# EAGLE design ARTIC_R2_Module (EAGLE 9.6.2)
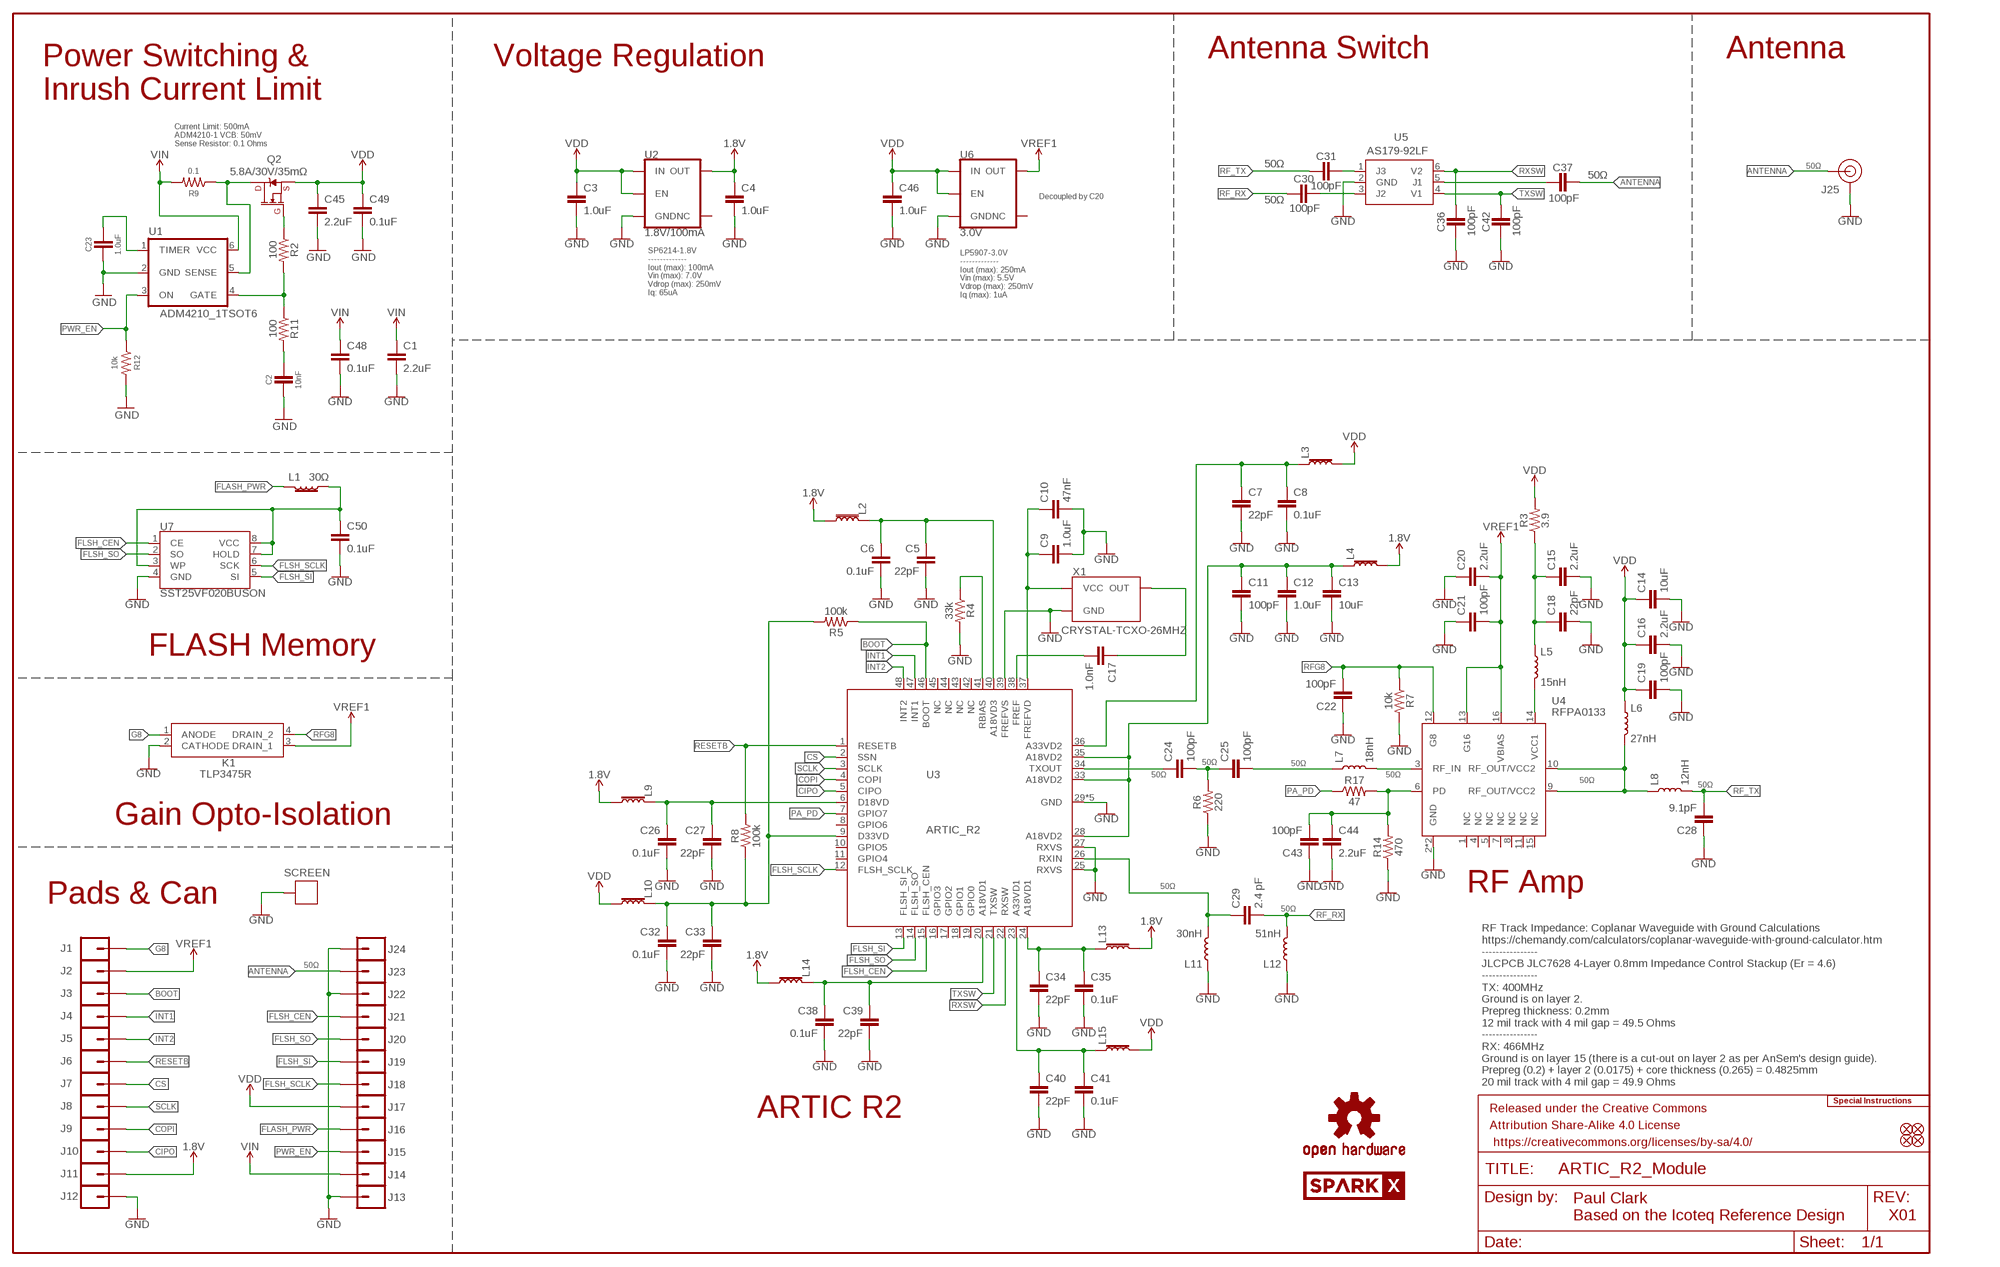
[diagram p0: schematic, sheet 1]

## Parts
C1  2.2uF  2.2UF-0402_TIGHT-10V-10%-X5R  [0402-TIGHT]
C2  10nF  10NF-0402T-25V-10%  [0402-TIGHT]
C3  1.0uF  1.0UF-0402T-16V-10%  [0402-TIGHT]
C4  1.0uF  1.0UF-0402T-16V-10%  [0402-TIGHT]
C5  22pF  22PF-0402T-16V-10%  [0402-TIGHT]
C6  0.1uF  0.1UF-0402T-6.3V-10%-X7R  [0402-TIGHT]
C7  22pF  22PF-0402T-16V-10%  [0402-TIGHT]
C8  0.1uF  0.1UF-0402T-6.3V-10%-X7R  [0402-TIGHT]
C9  1.0uF  1.0UF-0402T-16V-10%  [0402-TIGHT]
C10  47nF  47NF-0402_TIGHT-25V-10%-X7R  [0402-TIGHT]
C11  100pF  100PF-0402T-50V-5%  [0402-TIGHT]
C12  1.0uF  1.0UF-0402T-16V-10%  [0402-TIGHT]
C13  10uF  10UF-0402T-6.3V-20%  [0402-TIGHT]
C14  10uF  10UF-0402T-6.3V-20%  [0402-TIGHT]
C15  2.2uF  2.2UF-0402_TIGHT-10V-10%-X5R  [0402-TIGHT]
C16  2.2uF  2.2UF-0402_TIGHT-10V-10%-X5R  [0402-TIGHT]
C17  1.0nF  1.0NF/1000PF-0402_TIGHT-50V-10%  [0402-TIGHT]
C18  22pF  22PF-0402T-16V-10%  [0402-TIGHT]
C19  100pF  100PF-0402T-50V-5%  [0402-TIGHT]
C20  2.2uF  2.2UF-0402_TIGHT-10V-10%-X5R  [0402-TIGHT]
C21  100pF  100PF-0402T-50V-5%  [0402-TIGHT]
C22  100pF  100PF-0402T-50V-5%  [0402-TIGHT]
C23  1.0uF  1.0UF-0402T-16V-10%  [0402-TIGHT]
C24  100pF  100PF-0402T-50V-5%  [0402-TIGHT]
C25  100pF  100PF-0402T-50V-5%  [0402-TIGHT]
C26  0.1uF  0.1UF-0402T-6.3V-10%-X7R  [0402-TIGHT]
C27  22pF  22PF-0402T-16V-10%  [0402-TIGHT]
C28  9.1pF  9.1PF-0402-TIGHT  [0402-TIGHT]
C29  2.4 pF  2.4PF-0402  [0402_MURATA]
C30  100pF  100PF-0402T-50V-5%  [0402-TIGHT]
C31  100pF  100PF-0402T-50V-5%  [0402-TIGHT]
C32  0.1uF  0.1UF-0402T-6.3V-10%-X7R  [0402-TIGHT]
C33  22pF  22PF-0402T-16V-10%  [0402-TIGHT]
C34  22pF  22PF-0402T-16V-10%  [0402-TIGHT]
C35  0.1uF  0.1UF-0402T-6.3V-10%-X7R  [0402-TIGHT]
C36  100pF  100PF-0402T-50V-5%  [0402-TIGHT]
C37  100pF  100PF-0402T-50V-5%  [0402-TIGHT]
C38  0.1uF  0.1UF-0402T-6.3V-10%-X7R  [0402-TIGHT]
C39  22pF  22PF-0402T-16V-10%  [0402-TIGHT]
C40  22pF  22PF-0402T-16V-10%  [0402-TIGHT]
C41  0.1uF  0.1UF-0402T-6.3V-10%-X7R  [0402-TIGHT]
C42  100pF  100PF-0402T-50V-5%  [0402-TIGHT]
C43  100pF  100PF-0402T-50V-5%  [0402-TIGHT]
C44  2.2uF  2.2UF-0402_TIGHT-10V-10%-X5R  [0402-TIGHT]
C45  2.2uF  2.2UF-0402_TIGHT-10V-10%-X5R  [0402-TIGHT]
C46  1.0uF  1.0UF-0402T-16V-10%  [0402-TIGHT]
C48  0.1uF  0.1UF-0402T-10V-10%-X7R  [0402-TIGHT]
C49  0.1uF  0.1UF-0402T-10V-10%-X7R  [0402-TIGHT]
C50  0.1uF  0.1UF-0402T-6.3V-10%-X7R  [0402-TIGHT]
FD1  FIDUCIAL1X2  [FIDUCIAL-1X2]
FD2  FIDUCIAL1X2  [FIDUCIAL-1X2]
FD3  FIDUCIAL1X2  [FIDUCIAL-1X2]
FD4  FIDUCIAL1X2  [FIDUCIAL-1X2]
FRAME1  FRAME-LEDGER  [CREATIVE_COMMONS]
J1  CONN_01_CASTELLATED_4LAYERWITHOUT_VIA  [CONN_01_CASTELLATED_4LAYER]
J2  CONN_01_CASTELLATED_4LAYERWITHOUT_VIA  [CONN_01_CASTELLATED_4LAYER]
J3  CONN_01_CASTELLATED_4LAYERWITHOUT_VIA  [CONN_01_CASTELLATED_4LAYER]
J4  CONN_01_CASTELLATED_4LAYERWITHOUT_VIA  [CONN_01_CASTELLATED_4LAYER]
J5  CONN_01_CASTELLATED_4LAYERWITHOUT_VIA  [CONN_01_CASTELLATED_4LAYER]
J6  CONN_01_CASTELLATED_4LAYERWITHOUT_VIA  [CONN_01_CASTELLATED_4LAYER]
J7  CONN_01_CASTELLATED_4LAYERWITHOUT_VIA  [CONN_01_CASTELLATED_4LAYER]
J8  CONN_01_CASTELLATED_4LAYERWITHOUT_VIA  [CONN_01_CASTELLATED_4LAYER]
J9  CONN_01_CASTELLATED_4LAYERWITHOUT_VIA  [CONN_01_CASTELLATED_4LAYER]
J10  CONN_01_CASTELLATED_4LAYERWITHOUT_VIA  [CONN_01_CASTELLATED_4LAYER]
J11  CONN_01_CASTELLATED_4LAYERWITHOUT_VIA  [CONN_01_CASTELLATED_4LAYER]
J12  CONN_01_CASTELLATED_4LAYERWITHOUT_VIA  [CONN_01_CASTELLATED_4LAYER]
J13  CONN_01_CASTELLATED_4LAYERWITHOUT_VIA  [CONN_01_CASTELLATED_4LAYER]
J14  CONN_01_CASTELLATED_4LAYERWITHOUT_VIA  [CONN_01_CASTELLATED_4LAYER]
J15  CONN_01_CASTELLATED_4LAYERWITHOUT_VIA  [CONN_01_CASTELLATED_4LAYER]
J16  CONN_01_CASTELLATED_4LAYERWITHOUT_VIA  [CONN_01_CASTELLATED_4LAYER]
J17  CONN_01_CASTELLATED_4LAYERWITHOUT_VIA  [CONN_01_CASTELLATED_4LAYER]
J18  CONN_01_CASTELLATED_4LAYERWITHOUT_VIA  [CONN_01_CASTELLATED_4LAYER]
J19  CONN_01_CASTELLATED_4LAYERWITHOUT_VIA  [CONN_01_CASTELLATED_4LAYER]
J20  CONN_01_CASTELLATED_4LAYERWITHOUT_VIA  [CONN_01_CASTELLATED_4LAYER]
J21  CONN_01_CASTELLATED_4LAYERWITHOUT_VIA  [CONN_01_CASTELLATED_4LAYER]
J22  CONN_01_CASTELLATED_4LAYERWITHOUT_VIA  [CONN_01_CASTELLATED_4LAYER]
J23  CONN_01_CASTELLATED_4LAYERWITHOUT_VIA  [CONN_01_CASTELLATED_4LAYER]
J24  CONN_01_CASTELLATED_4LAYERWITHOUT_VIA  [CONN_01_CASTELLATED_4LAYER]
J25  U.FL  U.FL2PIN-REDUCED-FOOTPRINT  [U.FL_REDUCED_FOOTPRINT]
K1  TLP3475R  [TLP3475RTPF]
L1  30Ω  FERRITE_BEAD-0402-30OHM-100MHZ  [0402-TIGHT]
L2  30Ω  FERRITE_BEAD-0402-30OHM-100MHZ  [0402-TIGHT]
L3  30Ω  FERRITE_BEAD-0402-30OHM-100MHZ  [0402-TIGHT]
L4  30Ω  FERRITE_BEAD-0402-30OHM-100MHZ  [0402-TIGHT]
L5  15nH  15NH-0402  [0402_COILCRAFT]
L6  27nH  27NH-0402  [0402_COILCRAFT]
L7  18nH  18NH-0402  [0402_COILCRAFT]
L8  12nH  12NH-0402  [0402_COILCRAFT]
L9  30Ω  FERRITE_BEAD-0402-30OHM-100MHZ  [0402-TIGHT]
L10  30Ω  FERRITE_BEAD-0402-30OHM-100MHZ  [0402-TIGHT]
L11  30nH  30NH-0402  [0402_COILCRAFT]
L12  51nH  51NH-0402  [0402_COILCRAFT]
L13  30Ω  FERRITE_BEAD-0402-30OHM-100MHZ  [0402-TIGHT]
L14  30Ω  FERRITE_BEAD-0402-30OHM-100MHZ  [0402-TIGHT]
L15  30Ω  FERRITE_BEAD-0402-30OHM-100MHZ  [0402-TIGHT]
LOGO1  SPECIAL_INSTRUCTIONS-ORDERING  [ORDERING_INSTRUCTIONS]
LOGO3  OSHW-LOGOS  [OSHW-LOGO-S]
Q2  5.8A/30V/35mΩ  MOSFET-NCH-AO3404A  [SOT23-3]
R2  100  100OHM-0402-TIGHT-1/16W-1%  [0402-TIGHT]
R3  3.9  3.9OHM-0402-TIGHT-1/16W-1%  [0402-TIGHT]
R4  33k  33KOHM-0402T-1/16W-1%  [0402-TIGHT]
R5  100k  100KOHM-0402T-1/16W-1%  [0402-TIGHT]
R6  220  220OHM-0402-TIGHT-1/16W-1%  [0402-TIGHT]
R7  10k  10KOHM-0402T-1/16W-1%  [0402-TIGHT]
R8  100k  100KOHM-0402T-1/16W-1%  [0402-TIGHT]
R9  0.1  0.1OHM-0603-1/3W-1%  [0603]
R11  100  100OHM-0402-TIGHT-1/16W-1%  [0402-TIGHT]
R12  10k  10KOHM-0402T-1/16W-1%  [0402-TIGHT]
R14  470  470OHM-0402-TIGHT-1/16W-1%  [0402-TIGHT]
R17  47  47OHM-0402-TIGHT-1/16W-1%  [0402-TIGHT]
SCREEN  IOTA_SCREENING_CANSTRAIGHT_SLOTS  [IOTA_CAN_STRAIGHT_SLOTS]
SPARKX2  SPARKX-LOGO4  [SPARKX-MEDIUM]
U1  ADM4210_1TSOT6  [TSOT6]
U2  1.8V/100mA  V_REG_SP6214-1.8V  [SC70]
U3  ARTIC_R2  [QFN-48]
U4  RFPA0133  [QFN50P300X300X86-17N]
U5  AS179-92LF  [SOT65P220X100-6N]
U6  3.0V  V_REG_LP5907SOT23-3.0V  [SOT23-5]
U7  SST25VF020BUSON  [USON_3X2MM]
X1  CRYSTAL-TCXO-26MHZ  [CRYSTAL-TCXO-SMD-1.65X1.25]

## Nets
1.8V: C4.1 J11.1 L2.2 L4.2 L9.2 L13.2 L14.2 U2.5(OUT)
ANTENNA: C37.1 J23.1 J25.FEED(SIGNAL)
BOOT: J3.1 R5.1 U3.46(BOOT)
CIPO: J10.1 U3.5(CIPO)
COPI: J9.1 U3.4(COPI)
CS: J7.1 U3.2(SSN)
FLASH_PWR: J16.1 L1.2
FLASH_VCC: C50.1 L1.1 U7.3(WP) U7.7(HOLD) U7.8(VCC)
FLSH_CEN: J21.1 U3.15(FLSH_CEN) U7.1(CE)
FLSH_SCLK: J18.1 U3.12(FLSH_SCLK) U7.6(SCK)
FLSH_SI: J19.1 U3.13(FLSH_SI) U7.5(SI)
FLSH_SO: J20.1 U3.14(FLSH_SO) U7.2(SO)
G8: J1.1 K1.1(ANODE)
GND: C1.2 C2.2 C3.2 C4.2 C5.2 C6.2 C7.2 C8.2 C9.2 C10.2 C11.2 C12.2 C13.2 C14.2 C15.2 C16.2 C18.2 C19.2 C20.1 C21.1 C22.1 C23.2 C26.2 C27.2 C28.1 C32.2 C33.2 C34.2 C35.2 C36.2 C38.2 C39.2 C40.2 C41.2 C42.2 C43.1 C44.2 C45.2 C46.2 C48.2 C49.2 C50.2 J12.1 J13.1 J22.1 J24.1 J25.1(GND) J25.2(GND) K1.2(CATHODE) L11.P$1 L12.P$1 R4.2 R6.1 R7.2 R12.2 R14.1 SCREEN.1-1 SCREEN.1-16 SCREEN.2 SCREEN.3-1 SCREEN.3-16 SCREEN.4 U1.2(GND) U2.2(GND) U3.25(RXVS) U3.27(RXVS) U3.29(GND) U3.30(GND) U3.31(GND) U3.32(GND) U3.39(FREFVS) U3.GND U4.2(GND) U4.EDAP(GND) U5.2(GND) U6.2(GND) U7.4(GND) X1.1(GND) X1.2(GND)
INT1: J4.1 U3.47(INT1)
INT2: J5.1 U3.48(INT2)
N$1: Q2.3(D) R9.1 U1.5(SENSE)
N$2: Q2.1(G) R2.1
N$3: R2.2 R11.1 U1.4(GATE)
N$4: C34.1 C35.1 L13.1 U3.24(A18VD1)
N$5: C40.1 C41.1 L15.1 U3.23(A33VD1)
N$6: C2.1 R11.2
N$7: C23.1 U1.1(TIMER)
N$8: C26.1 C27.1 L9.1 U3.6(D18VD)
N$9: C32.1 C33.1 L10.1 R5.2 R8.1 U3.9(D33VD)
N$10: C11.1 C12.1 C13.1 L4.1 U3.28(A18VD2) U3.33(A18VD2) U3.35(A18VD2)
N$11: C7.1 C8.1 L3.1 U3.36(A33VD2)
N$12: R4.1 U3.41(RBIAS)
N$13: C5.1 C6.1 L2.1 U3.40(A18VD3)
N$14: C9.1 C10.1 U3.37(FREFVD) X1.4(VCC)
N$15: C17.1 X1.3(OUT)
N$16: C17.2 U3.38(FREF)
N$17: C24.1 U3.34(TXOUT)
N$18: C24.2 C25.1 R6.2
N$19: L5.P$2 U4.14(VCC1)
N$20: C15.1 C18.1 L5.P$1 R3.1
N$21: C29.P$1 L11.P$2 U3.26(RXIN)
N$24: C25.2 L7.P$1
N$25: L7.P$2 U4.3(RF_IN)
N$26: L6.P$2 L8.P$1 U4.9(RF_OUT/VCC2) U4.10(RF_OUT/VCC2)
N$28: C31.1 U5.1(J3)
N$29: C30.1 U5.3(J2)
N$30: C37.2 U5.5(J1)
N$31: C38.1 C39.1 L14.1 U3.20(A18VD1)
PA_PD: R17.1 U3.7(GPIO7)
PD: C43.2 C44.1 R14.2 R17.2 U4.6(PD)
PWR_EN: J15.1 R12.1 U1.3(ON)
RESETB: J6.1 R8.2 U3.1(RESETB)
RF_RX: C29.P$2 C30.2 L12.P$2
RF_TX: C28.2 C31.2 L8.P$2
RFG8: C22.2 K1.4(DRAIN_2) R7.1 U4.12(G8)
RXSW: C36.1 U3.22(RXSW) U5.6(V2)
SCLK: J8.1 U3.3(SCLK)
TXSW: C42.1 U3.21(TXSW) U5.4(V1)
VDD: C3.1 C14.1 C16.1 C19.1 C45.1 C46.1 C49.1 J17.1 L3.2 L6.P$1 L10.2 L15.2 Q2.2(S) R3.2 U2.1(IN) U2.3(EN) U6.1(IN) U6.3(EN)
VIN: C1.1 C48.1 J14.1 R9.2 U1.6(VCC)
VREF1: C20.2 C21.2 J2.1 K1.3(DRAIN_1) U4.13(G16) U4.16(VBIAS) U6.5(OUT)
Unconnected: U2.4(NC) U3.8(GPIO6) U3.10(GPIO5) U3.11(GPIO4) U3.16(GPIO3) U3.17(GPIO2) U3.18(GPIO1) U3.19(GPIO0) U3.42(NC) U3.43(NC) U3.44(NC) U3.45(NC) U4.1(NC) U4.4(NC) U4.5(NC) U4.7(NC) U4.8(NC) U4.11(NC) U4.15(NC) U6.4(NC)

## Notes on the sheet
- Voltage Regulation | Antenna Switch | Antenna
- Power Switching &
  Inrush Current Limit
- Current Limit: 500mA
  ADM4210-1 VCB: 50mV
  Sense Resistor: 0.1 Ohms
- 50Ω | 50Ω
- 50Ω
- Decoupled by C20
- 50Ω
- SP6214-1.8V
  -------------
  Iout (max): 100mA 
  Vin (max): 7.0V
  Vdrop (max): 250mV
  Iq: 65uA
- LP5907-3.0V
  -------------
  Iout (max): 250mA 
  Vin (max): 5.5V
  Vdrop (max): 250mV
  Iq (max): 1uA
- FLASH Memory
- 50Ω | 50Ω
- 50Ω | 50Ω
- 50Ω
- 50Ω
- Gain Opto-Isolation
- 50Ω
- RF Amp
- Pads & Can
- 50Ω
- RF Track Impedance: Coplanar Waveguide with Ground Calculations
  https://chemandy.com/calculators/coplanar-waveguide-with-ground-calculator.htm
  ----------------
  JLCPCB JLC7628 4-Layer 0.8mm Impedance Control Stackup (Er = 4.6)
  ----------------
  TX: 400MHz
  Ground is on layer 2.
  Prepreg thickness: 0.2mm
  12 mil track with 4 mil gap = 49.5 Ohms
  ----------------
  RX: 466MHz
  Ground is on layer 15 (there is a cut-out on layer 2 as per AnSem's design guide).
  Prepreg (0.2) + layer 2 (0.0175) + core thickness (0.265) = 0.4825mm
  20 mil track with 4 mil gap = 49.9 Ohms
- 50Ω
- ARTIC R2
- Paul Clark
  Based on the Icoteq Reference Design
- X01

## Library data of the parts
C1 C15 C16 C20 C44 C45 = SparkFun-Capacitors:2.2UF: 2.2µF ceramic capacitors A capacitor is a passive two-terminal electrical component used to store electrical energy temporarily in an electric field.; PROD_ID: CAP-14232
C2 = SparkFun-Capacitors:10NF: 0.01uF/10nF/10,000pF ceramic capacitors A capacitor is a passive two-terminal electrical component used to store electrical energy temporarily in an electric field. CAP-09321; PROD_ID: CAP-14847
C3 C4 C9 C12 C23 C46 = SparkFun-Capacitors:1.0UF: 1µF ceramic capacitors A capacitor is a passive two-terminal electrical component used to store electrical energy temporarily in an electric field.; PROD_ID: CAP-12417
C5 C7 C18 C27 C33 C34 C39 C40 = SparkFun-Capacitors:22PF: 22pF ceramic capacitors A capacitor is a passive two-terminal electrical component used to store electrical energy temporarily in an electric field.; PROD_ID: CAP-14674
C6 C8 C26 C32 C35 C38 C41 C50 = SparkFun-Capacitors:0.1UF: 0.1µF ceramic capacitors A capacitor is a passive two-terminal electrical component used to store electrical energy temporarily in an electric field.; PROD_ID: CAP-14993
C10 = SparkFun-Capacitors:47NF: 47nF ceramic capacitors A capacitor is a passive two-terminal electrical component used to store electrical energy temporarily in an electric field.; PROD_ID: CAP-14243
C11 C19 C21 C22 C24 C25 C30 C31 C36 C37 C42 C43 = SparkFun-Capacitors:100PF: 100pF/0.1nF ceramic capacitors A capacitor is a passive two-terminal electrical component used to store electrical energy temporarily in an electric field.; PROD_ID: CAP-13458
C13 C14 = SparkFun-Capacitors:10UF: 10.0µF ceramic capacitors A capacitor is a passive two-terminal electrical component used to store electrical energy temporarily in an electric field.; PROD_ID: CAP-14848
C17 = SparkFun-Capacitors:1.0NF/1000PF: 1nF/1,000pF ceramic capacitors A capacitor is a passive two-terminal electrical component used to store electrical energy temporarily in an electric field.; PROD_ID: CAP-14280
C28 = SparkFun-Capacitors:9.1PF: 9.1pF ceramic capacitors A capacitor is a passive two-terminal electrical component used to store electrical energy temporarily in an electric field.; MOUSER_PART: 609-500R07S9R1CV4T; PROD_ID: CAP-15278
C29 = SparkFun-Capacitors:2.4PF; PROD_ID: CAP-14351
C48 C49 = SparkFun-Capacitors:0.1UF: 0.1µF ceramic capacitors A capacitor is a passive two-terminal electrical component used to store electrical energy temporarily in an electric field.; PROD_ID: CAP-15083
FD1-FD4 = SparkFun-Aesthetics:FIDUCIAL: Fiducial Alignment Points Point-of-reference for pick-and-place machines and other optical instruments.
FRAME1 = SparkFun-Aesthetics:FRAME-LEDGER: Schematic Frame - Ledger Standard 11x14 US Ledger frame
J1-J24 = New_Parts_Connectors:CONN_01_CASTELLATED_4LAYER: A castellated pad for 4-layer boards. Place the center of the pad on the dimension line. You will get a bunch of dimension and drill distance errors but there's not much we can do about that.
J25 = SparkFun-Connectors:U.FL2PIN: SMD Antenna Connector - U.FL 2mm height, 3.0mm x 3.0mm receptacle size. SparkFun Products: SparkFun WiFi Shield - ESP8266 <https://www.sparkfun.com/products/13287> SparkFun ESP8266 Thing <https://www.sparkfun.com/products/13231> SparkFun MiniGen - Pro Mini Signal Generator Shield <https://www.sparkfun.com/products/11420>; PROD_ID: CONN-09193
K1 = SparkFun-DiscreteSemi:TLP3475R: Solid State Relays - PCB Mount Photo-IC 300mA 50V 500Vrms Source: Datasheet <http://toshiba.semicon-storage.com/info/docget.jsp?did=55304&prodName=TLP3475R> OBSOLETE - use TLP3475SRHA; DESCRIPTION: Solid State Relays - PCB Mount Photo-IC 300mA 50V 500Vrms; DIGIKEY_PART: TLP3475R(TPFCT-ND - Cut Tape (CT); MANUFACTURER_NAME: Toshiba; MANUFACTURER_PART_NUMBER: TLP3475R; PROD_ID: IC-15447
L1-L4 L9 L10 L13-L15 = SparkFun-Coils:FERRITE_BEAD: Ferrite Bead (blocks, cores, rings, chokes, etc.) Inductor with layers of ferrite used to suppress high frequencies. Often used to isolate high frequency noise. SparkFun Products: IOIO-OTG - V2.2 <https://www.sparkfun.com/products/13613> SparkFun SAMD21 Mini Breakout <https://www.sparkfun.com/products/13664> SparkFun 6 Degrees of Freedom Breakout - LSM6DS3 <https://www.sparkfun.com/products/13339> SparkFun SAMD21 Dev Breakout <https://www.sparkfun.com/products/13672>; PROD_ID: NDUC-15133
L5 = SparkFun-Coils:15NH; MOUSER_PART: 994-0402HP-15NXGLU; PROD_ID: NDUC-15272
L6 = SparkFun-Coils:27NH; MOUSER_PART: 994-0402HP-27NXGLU; PROD_ID: NDUC-15273
L7 = SparkFun-Coils:18NH; MOUSER_PART: 994-0402HP-18NXGLU; PROD_ID: NDUC-15277
L8 = SparkFun-Coils:12NH; MOUSER_PART: 994-0402HP-12NXGLU; PROD_ID: NDUC-15271
L11 = SparkFun-Coils:30NH; MOUSER_PART: 994-0402HP-30NXGLU; PROD_ID: NDUC-15275
L12 = SparkFun-Coils:51NH; MOUSER_PART: 994-0402HP-51NXGLU; PROD_ID: NDUC-15276
LOGO1 = SparkFun-Aesthetics:SPECIAL_INSTRUCTIONS: Special Ordering/Production Instructions Alert Symbol for special PCB ordering instructions or unique production process warnings. Ordering Instructions Production Instructions Types of information that should be added to box: Copper weight Soldermask color Silk color PCB thickness Number of layers PCB Standard: 1.6mm FR4 1 oz copper immersion silver plating red soldermask white silkscreen Types of information that should be added to box: Special wash requirements Depaneling instructions Humidification Glue curing Default text settings: 0.07 inch 9% ratio 50% line distance
LOGO3 = SparkFun-Aesthetics:OSHW-LOGO: Open-Source Hardware (OSHW) Logo This logo indicates the piece of hardware it is found on incorporates a OSHW license and/or adheres to the definition of open source hardware found here: http://freedomdefined.org/OSHW
Q2 = SparkFun-DiscreteSemi:MOSFET-NCH: N-channel MOSFETs Voltage controlled devices that allow control of high current outputs. SparkFun Products: SparkFun OpenScale <https://www.sparkfun.com/products/13261> SparkFun Digital Sandbox <https://www.sparkfun.com/products/12651> SparkFun Monster Moto Shield <https://www.sparkfun.com/products/10182> SparkFun MOSFET Power Controller <https://www.sparkfun.com/products/11214>; PROD_ID: TRANS-12988
R2 R11 = SparkFun-Resistors:100OHM: 100Ω resistor A resistor is a passive two-terminal electrical component that implements electrical resistance as a circuit element. Resistors act to reduce current flow, and, at the same time, act to lower voltage levels within circuits. - Wikipedia; PROD_ID: RES-14962
R3 = SparkFun-Resistors:3.9OHM: 3.9Ω resistor A resistor is a passive two-terminal electrical component that implements electrical resistance as a circuit element. Resistors act to reduce current flow, and, at the same time, act to lower voltage levels within circuits. - Wikipedia; PROD_ID: RES-15270
R4 = SparkFun-Resistors:33KOHM: 33kΩ resistor A resistor is a passive two-terminal electrical component that implements electrical resistance as a circuit element. Resistors act to reduce current flow, and, at the same time, act to lower voltage levels within circuits. - Wikipedia; PROD_ID: RES-15128
R5 R8 = SparkFun-Resistors:100KOHM: 100kΩ resistor A resistor is a passive two-terminal electrical component that implements electrical resistance as a circuit element. Resistors act to reduce current flow, and, at the same time, act to lower voltage levels within circuits. - Wikipedia; PROD_ID: RES-13495
R6 = SparkFun-Resistors:220OHM: 220Ω resistor A resistor is a passive two-terminal electrical component that implements electrical resistance as a circuit element. Resistors act to reduce current flow, and, at the same time, act to lower voltage levels within circuits. - Wikipedia; PROD_ID: RES-15269
R7 R12 = SparkFun-Resistors:10KOHM: 10kΩ resistor A resistor is a passive two-terminal electrical component that implements electrical resistance as a circuit element. Resistors act to reduce current flow, and, at the same time, act to lower voltage levels within circuits. - Wikipedia; PROD_ID: RES-14241
R9 = SparkFun-Resistors:0.1OHM: 0.1Ω resistor A resistor is a passive two-terminal electrical component that implements electrical resistance as a circuit element. Resistors act to reduce current flow, and, at the same time, act to lower voltage levels within circuits. - Wikipedia; PROD_ID: RES-15715
R14 = SparkFun-Resistors:470OHM: 470Ω resistor A resistor is a passive two-terminal electrical component that implements electrical resistance as a circuit element. Resistors act to reduce current flow, and, at the same time, act to lower voltage levels within circuits. - Wikipedia; PROD_ID: RES-15584
R17 = SparkFun-Resistors:47OHM: 47Ω resistor A resistor is a passive two-terminal electrical component that implements electrical resistance as a circuit element. Resistors act to reduce current flow, and, at the same time, act to lower voltage levels within circuits. - Wikipedia; PROD_ID: RES-15585
SCREEN = New_Parts_Screening_Cans:IOTA_SCREENING_CAN: A screening can for the IOTA ARGOS ARTIC R2 castellated module
SPARKX2 = SparkX:SPARKX-LOGO
U1 = SparkFun-IC-Power:ADM4210_1: Hot Swap Controller (In-Rush Current Limiter); PROD_ID: IC-14694
U2 = SparkFun-IC-Power:V_REG_SP6214: Voltage Regulator - SP6214 SP6214 Series SC-70-5 Micropower SC-70 100 mA CMOS LDO Regulator Datasheet <https://www.exar.com/content/document.ashx?id=654> SparkFun Products: MP3 Trigger <https://www.sparkfun.com/products/13720> SparkFun Particle Sensor Breakout <https://www.sparkfun.com/products/14045>; PROD_ID: VREG-08428
U3 = SparkFun-RF:ARTIC_R2: AnSem ARTIC R2 Chipset The ARTIC is an integrated low power small size ARGOS 2/3/4 single chip radio. ARTIC implements a message based wireless interface. For satellite uplink communication, ARTIC will encode, modulate and transmit provided user messages. For downlink communication, ARTIC will lock to the downstream, demodulate and decode and extract the satellite messages. The ARTIC can transmit signals in frequency bands around 400MHz and receive signals in the bands around 466MHz, in accordance with the ARGOS satellite system specifications. The ARTIC is compliant and certified for all ARGOS 2 and ARGOS 3 TX standards. It contains a RF transceiver, afrequency synthesizer and a digital baseband modem. The ARTIC contains an on-chip power amplifier delivering 1mW [0dBm] output power, that serves as an output for connecting an external high efficient PA. The (de)modulation algorithms run on an on-chip DSP. This software approach allows for retargeting the ARTIC for other applications. The DSP program can be retained on an external flash or the MCU.; PROD_ID: IC-15312
U4 = SparkFun-RF:RFPA0133: IC PROG PWR AMP 16-QFN Source: Datasheet <http://www.qorvo.com/products/d/da000936>; MANUFACTURER_NAME: Qorvo; MANUFACTURER_PART_NUMBER: RFPA0133TR7; MOUSER_PART_NUMBER: 772-RFPA0133; PROD_ID: IC-15274
U5 = SparkFun-RF:AS179-92LF: SKYWORKS SOLUTIONS - AS179-92LF - IC, SWITCH, RF, SPDT, 0.02-3.0GHZ Source: Datasheet <http://www.skyworksinc.com/uploads/documents/AS179_92LF_200176H.pdf>; PROD_ID: IC-15047
U6 = SparkFun-IC-Power:V_REG_LP5907: LP5907 - 250mA Ultra-Low-Noise LDO Regulator w/ Enable The LP5907 is a low-noise LDO that can supply up to 250 mA output current. Designed to meet the requirements of RF and analog circuits, the LP5907 device provides low noise, high PSRR, low quiescent current, and low line or load transient response figures. Using new innovative design techniques, the LP5907 offers class-leading noise performance without a noise bypass capacitor and the ability for remote output capacitor placement. The device is designed to work with a 1-µF input and a 1-µF output ceramic capacitor (no separate noise bypass capacitor is required). This device is available with fixed output voltages from 1.2 V to 4.5 V in 25-mV steps.; DIGIKEY_PART: 296-40357-1-ND; MANU_PART: LP5907MFX-3.0/NOPB; MOUSER_PART: 595-LP5907MFX-3.0NPB; PACKAGE: SOT-23(5); PROD_ID: VREG-15586
U7 = SparkFun-IC-Memory:SST25VF020B: 2Mbit Serial Flash Memory 8pin SPI Flash Datasheet <http://ww1.microchip.com/downloads/en/DeviceDoc/20005054D.pdf>; DIGIKEY_PART: SST25VF020B-80-4I-Q3AE-TCT-ND; MANU_PART: SST25VF020B-80-4I-Q3AE-T; PROD_ID: IC-15716
X1 = SparkFun-Clocks:CRYSTAL-TCXO-26MHZ: 26MHz Crystal Oscillator IQXT-350 LFTCXO073004CUTT Datasheet <https://www.mouser.co.uk/datasheet/2/741/iqxt-350-1-33-1075257.pdf> Frequency: 26MHz Frequency Stability: ±0.50ppm Frequency Tolerance: ±1.50ppm; MOUSER_PART: 449-LFTCXO073004CUTT; PROD_ID: XTAL-15279

## Net classes
1 Power: width 0.305 mm

## Board
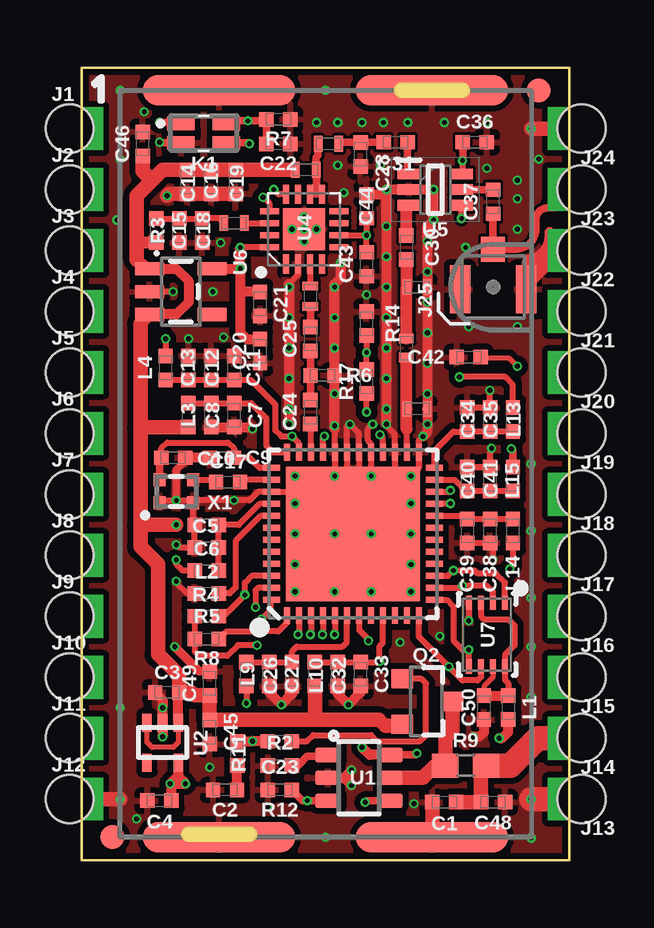
[diagram p1: board, top side]
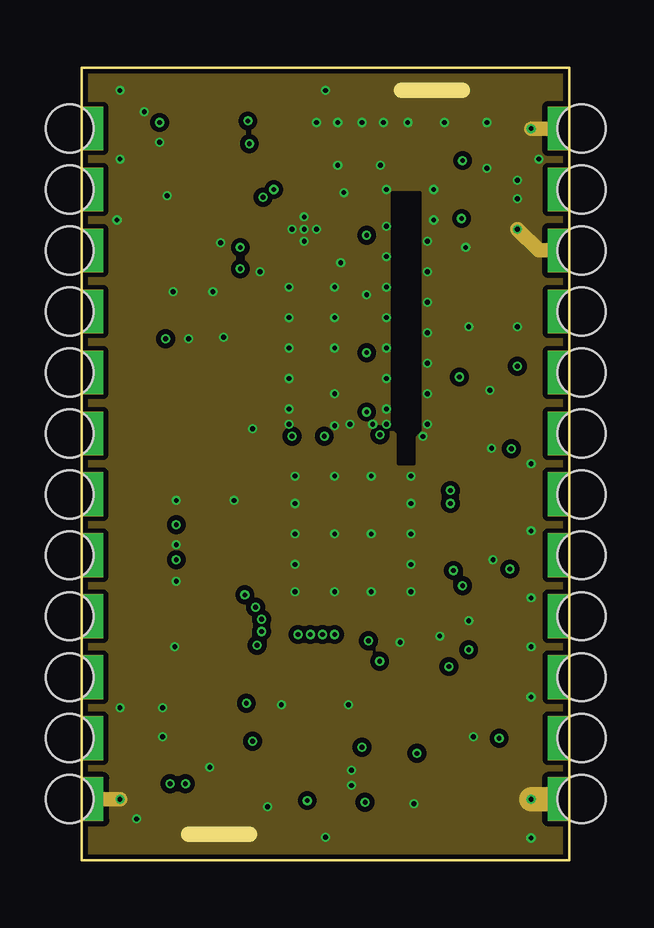
[diagram p2: board, inner layer Route2]
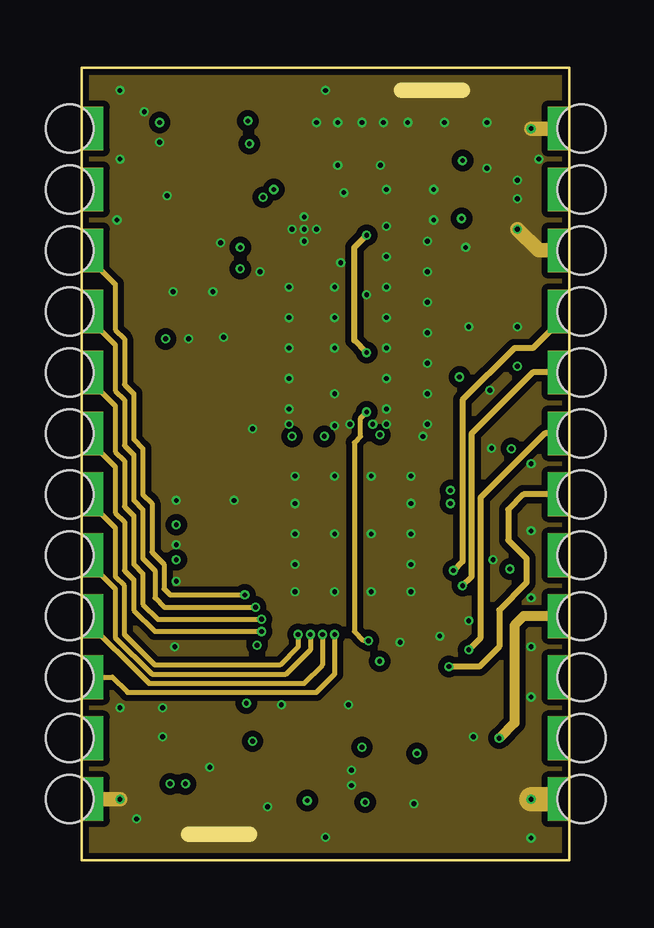
[diagram p3: board, inner layer Route15]
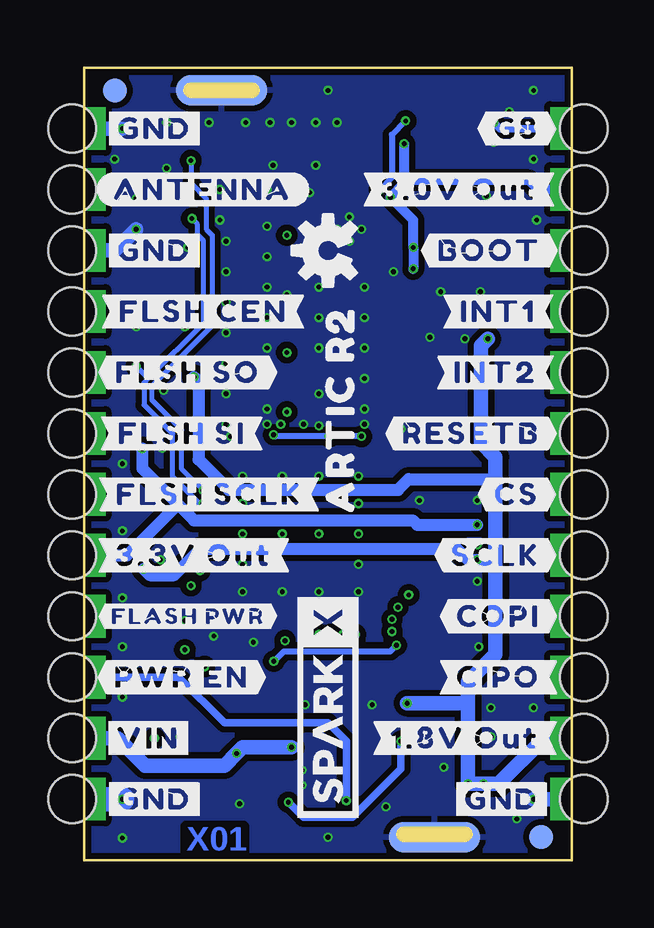
[diagram p4: board, bottom side, seen from below]

Size 20.32 x 33.02 mm. Coordinates in mm from the lower left corner, seen from the top.
Outline: 0,33.02 0,0 20.32,0 20.32,33.02 0,33.02
Copper layers (1+2*15+16): Top 0.035mm / dielectric 0.2mm / Route2 0.0175mm / dielectric 0.265mm / Route15 0.0175mm / dielectric 0.2mm / Bottom 0.035mm
Design rules "SparkFun-4_layer-Impedance_Control-JLCPCB-JLC7628": minimum track width 5mil, minimum drill 0.2mm, track to track 5mil, track to pad 5mil, pad to pad 5mil, via to via 5mil, smd to smd 0mil, copper to edge 5mil, drill to drill 5mil, minimum pad ring 3.5mil, minimum via ring 3.5mil, stop-mask expansion 2.5mil, vias tented up to drill 25mil, thermal gap 10mil
tRestrict: 3 lines

### Footprints (pad centres in the part's own frame; a part is rotated, then mirrored left to right if it is on the bottom)
0402-TIGHT = smd 0.6 x 0.6: 1 -0.5,0; 2 0.5,0
0402_MURATA = smd 0.4 x 0.6: P$1 -0.4,0; P$2 0.4,0
FIDUCIAL-1X2 = smd 1 x 1: 1 0,0
CONN_01_CASTELLATED_4LAYER = drill 0.3 pad 1.778 square: 1 0,0 | hole 1.999: -0.508,0
U.FL_REDUCED_FOOTPRINT = smd 2 x 0.85: 1 -0.1,1.375; 2 -0.1,-1.375 | smd 1.05 x 1: FEED 1.575,0
TLP3475RTPF = smd 1.15 x 0.55: 1 -0.95,0.4; 2 -0.95,-0.4; 3 0.95,-0.4; 4 0.95,0.4
0402_COILCRAFT = smd 0.356 x 0.66: P$1 -0.432,0; P$2 0.432,0
SOT23-3 = smd 0.8 x 0.9: 1 -0.95,-1; 2 0.95,-1; 3 0,1.1
0603 = smd 1.1 x 1: 1 -0.85,0; 2 0.85,0
IOTA_CAN_STRAIGHT_SLOTS = smd 6.35 x 1.27: 1-1 -4.445,-15.557; 2 4.445,-15.557; 3-1 4.445,15.557; 4 -4.445,15.557 | smd 3.81 x 1.27 bottom: 1-16 -4.445,-15.557; 3-16 4.445,15.557
TSOT6 = smd 0.6 x 1.05: 1 -0.95,-1.3; 2 0,-1.3; 3 0.95,-1.3; 4 0.95,1.3; 5 0,1.3; 6 -0.95,1.3
SC70 = smd 0.4 x 0.75: 1 -0.65,-0.825; 2 0,-0.825; 3 0.65,-0.825; 4 0.65,0.825; 5 -0.65,0.825
QFN-48 = smd 0.7 x 0.25: 1 -3.4,2.75; 2 -3.4,2.25; 3 -3.4,1.75; 4 -3.4,1.25; 5 -3.4,0.75; 6 -3.4,0.25; 7 -3.4,-0.25; 8 -3.4,-0.75; 9 -3.4,-1.25; 10 -3.4,-1.75; 11 -3.4,-2.25; 12 -3.4,-2.75; 25 3.4,-2.75; 26 3.4,-2.25; 27 3.4,-1.75; 28 3.4,-1.25; 29 3.4,-0.75; 30 3.4,-0.25; 31 3.4,0.25; 32 3.4,0.75; 33 3.4,1.25; 34 3.4,1.75; 35 3.4,2.25; 36 3.4,2.75 | smd 0.25 x 0.7: 13 -2.75,-3.4; 14 -2.25,-3.4; 15 -1.75,-3.4; 16 -1.25,-3.4; 17 -0.75,-3.4; 18 -0.25,-3.4; 19 0.25,-3.4; 20 0.75,-3.4; 21 1.25,-3.4; 22 1.75,-3.4; 23 2.25,-3.4; 24 2.75,-3.4; 37 2.75,3.4; 38 2.25,3.4; 39 1.75,3.4; 40 1.25,3.4; 41 0.75,3.4; 42 0.25,3.4; 43 -0.25,3.4; 44 -0.75,3.4; 45 -1.25,3.4; 46 -1.75,3.4; 47 -2.25,3.4; 48 -2.75,3.4 | smd 5.6 x 5.6: GND 0,0
QFN50P300X300X86-17N = smd 0.8 x 0.25: 1 -1.45,0.75; 2 -1.45,0.25; 3 -1.45,-0.25; 4 -1.45,-0.75; 9 1.45,-0.75; 10 1.45,-0.25; 11 1.45,0.25; 12 1.45,0.75 | smd 0.25 x 0.8: 5 -0.75,-1.45; 6 -0.25,-1.45; 7 0.25,-1.45; 8 0.75,-1.45; 13 0.75,1.45; 14 0.25,1.45; 15 -0.25,1.45; 16 -0.75,1.45 | smd 1.75 x 1.75: EDAP 0,0
SOT65P220X100-6N = smd 0.95 x 0.45: 1 -1.1,0.65; 2 -1.1,0; 3 -1.1,-0.65; 4 1.1,-0.65; 5 1.1,0; 6 1.1,0.65
SOT23-5 = smd 0.55 x 1.2: 1 -0.95,-1.3; 2 0,-1.3; 3 0.95,-1.3; 4 0.95,1.3; 5 -0.95,1.3
USON_3X2MM = smd 0.6 x 0.25: 1 -1.325,0.75; 2 -1.325,0.25; 3 -1.325,-0.25; 4 -1.325,-0.75; 5 1.325,-0.75; 6 1.325,-0.25; 7 1.325,0.25; 8 1.325,0.75
CRYSTAL-TCXO-SMD-1.65X1.25 = smd 0.5 x 0.55: 1 -0.7,-0.475; 2 0.7,-0.475; 3 0.7,0.475; 4 -0.7,0.475

### Placement (x,y rotation side)
C1  15.11,2.41 180 top
C2  5.97,2.92 180 top
C3  3.56,6.99 180 top
C4  3.24,2.48 180 top
C5  5.21,13.97 180 top
C6  5.21,13.02 180 top
C7  6.35,18.54 270 top
C8  5.4,18.54 270 top
C9  5.84,16.76 180 top
C10  3.81,16.76 0 top
C11  6.35,20.51 90 top
C12  5.4,20.51 90 top
C13  4.45,20.51 90 top
C14  4.38,28.26 270 top
C15  4.06,26.23 270 top
C16  5.4,28.26 270 top
C17  6.1,15.75 0 top
C18  5.02,26.23 270 top
C19  6.41,28.26 270 top
C20  7.43,21.21 90 top
C21  7.43,23.18 90 top
C22  8.19,29.84 180 top
C23  8.26,3.94 180 top
C24  9.53,18.67 90 top
C25  9.53,21.72 90 top
C26  7.81,7.75 270 top
C27  8.76,7.75 270 top
C28  11.62,29.4 90 top
C29  13.53,21.34 90 top
C30  13.53,25.53 270 top
C31  13.08,29.91 180 top
C32  10.67,7.75 270 top
C33  11.62,7.75 270 top
C34  16.07,18.35 90 top
C35  17.02,18.35 90 top
C36  16.38,29.91 0 top
C37  17.14,27.43 90 top
C38  17.02,13.72 270 top
C39  16.07,13.72 270 top
C40  16.07,15.88 90 top
C41  17.02,15.88 90 top
C42  16.13,20.95 180 top
C43  11.87,24.83 90 top
C44  11.87,27.24 90 top
C45  5.33,5.33 270 top
C46  2.54,29.84 90 top
C48  17.14,2.41 0 top
C49  5.33,7.37 90 top
C50  16.76,6.35 270 top
FD1  19.05,32.07 0 top
FD2  19.05,32.07 0 bottom
FD3  1.27,0.95 0 top
FD4  1.27,0.95 0 bottom
FRAME1  58.42,-10.16 0 top  (outside the outline)
J1  0,30.48 0 top
J2  0,27.94 0 top
J3  0,25.4 0 top
J4  0,22.86 0 top
J5  0,20.32 0 top
J6  0,17.78 0 top
J7  0,15.24 0 top
J8  0,12.7 0 top
J9  0,10.16 0 top
J10  0,7.62 0 top
J11  0,5.08 0 top
J12  0,2.54 0 top
J13  20.32,2.54 180 top
J14  20.32,5.08 180 top
J15  20.32,7.62 180 top
J16  20.32,10.16 180 top
J17  20.32,12.7 180 top
J18  20.32,15.24 180 top
J19  20.32,17.78 180 top
J20  20.32,20.32 180 top
J21  20.32,22.86 180 top
J22  20.32,25.4 180 top
J23  20.32,27.94 180 top
J24  20.32,30.48 180 top
J25  17.14,23.88 90 top
K1  5.08,30.29 0 top
L1  17.78,6.35 270 top
L2  5.21,12.06 180 top
L3  4.45,18.54 270 top
L4  3.49,20.51 90 top
L5  6.35,26.54 0 top
L6  9.33,28.77 0 top
L7  9.53,23.5 90 top
L8  10.29,29.84 0 top
L9  6.86,7.75 270 top
L10  9.72,7.75 270 top
L11  13.97,18.8 180 top
L12  13.97,23.88 180 top
L13  17.97,18.35 90 top
L14  17.97,13.72 270 top
L15  17.97,15.88 90 top
LOGO1  31.75,50.8 0 top  (outside the outline)
LOGO3  10.16,25.4 90 bottom
Q2  14.35,6.6 270 top
R2  8.26,4.95 180 top
R3  3.11,26.23 270 top
R4  5.21,11.11 180 top
R5  5.21,10.16 180 top
R6  10.03,20.19 180 top
R7  8.19,30.86 0 top
R8  5.21,9.21 0 top
R9  16,3.94 0 top
R11  6.48,4.45 270 top
R12  8.26,2.92 180 top
R14  11.87,22.35 270 top
R17  11.87,19.94 90 top
SCREEN  10.16,16.51 0 top
SPARKX2  10.16,6.35 90 bottom
U1  11.56,3.43 270 top
U2  3.37,4.89 180 top
U3  11.3,13.59 90 top
U4  9.27,26.29 90 top
U5  14.73,27.94 0 top
U6  4.13,23.69 270 top
U7  16.89,9.4 270 top
U$1  [#GND#0]  17.4,25.4 0 bottom
U$2  [10]  0.76,32.13 0 top
U$3  [#GND#0]  17.4,30.48 0 bottom
U$4  [#GND#0]  17.4,2.54 0 bottom
U$5  [#GND#0]  2.92,2.54 0 bottom
U$6  [#PWR_EN#0]  16.26,7.62 0 bottom
U$7  [#VIN#0]  17.65,5.08 0 bottom
U$8  [#FLASH_PWR#0]  16,10.16 0 bottom
U$9  [#FLSH_SCLK#0]  15.11,15.24 0 bottom
U$10  [#FLSH_SI#0]  16.26,17.78 0 bottom
U$11  [#FLSH_SO#0]  16,20.32 0 bottom
U$12  [#FLSH_CEN#0]  15.37,22.86 0 bottom
U$13  [#3#3V_OUT#0]  15.75,12.7 0 bottom
U$14  [#ANTENNA#0]  15.37,27.94 0 bottom
U$15  [#G8#0]  2.29,30.48 0 bottom
U$16  [#3#0V_OUT#0]  4.7,27.94 0 bottom
U$17  [#BOOT#0]  3.43,25.4 0 bottom
U$18  [#INT1#0]  3.05,22.86 0 bottom
U$19  [#INT2#0]  3.17,20.32 0 bottom
U$20  [#RESETB#0]  4.19,17.78 0 bottom
U$21  [#CS#0]  2.29,15.24 0 bottom
U$22  [#SCLK#0]  3.17,12.7 0 bottom
U$23  [#COPI#0]  3.05,10.16 0 bottom
U$24  [#CIPO#0]  3.05,7.62 0 bottom
U$25  [#1#8V_OUT#0]  4.45,5.08 0 bottom
U$26  [ARTIC_R20]  9.65,18.8 90 bottom
X1  3.94,15.37 0 top

### Tracks (layer width: path | path; a pad name or v marks a point on that pad's centre or on a via)
1.8V  (via drill 0.2)
  Top 0.254: v3.49,21.72 L4.2 | L2.2 4.2,12.06 3.94,12.33 v3.94,12.51 | L9.2 v6.86,6.54 | L14.2 17.97,12.26 v17.84,12.13 | L13.2 17.97,19.81 17.65,20.13 v15.75,20.13
  Top 0.406: v3.68,3.17 4.02,3.51 U2.5 4.02,3.48 v4.32,3.17 v3.68,3.17 | C4.1 3.74,3.12 v3.68,3.17
  Bottom 0.508: 3.17,12.51 v3.94,12.51 4.32,12.51 4.79,12.98 15.47,12.98 16.57,11.87 17.59,11.87 v17.84,12.13 | 3.17,15.88 6.79,15.88 7.24,15.43 14.29,15.43 15.56,16.7 15.56,19.94 v15.75,20.13
  Bottom 0.61: v3.49,21.72 3.78,21.43 3.78,17.4 3.17,16.79 3.17,15.88 3.17,12.51 3.17,8.57 4.32,7.43 4.32,6.6 | J11.1 1.14,5.08 3.05,3.17 v4.32,3.17 4.32,6.6 | 4.32,6.6 4.38,6.54 v6.86,6.54
ANTENNA
  Top 0.305: C37.1 J25.FEED 18.09,25.45 arc90 18.92,26.29 18.92,26.67 arc-90 19.43,27.18 19.56,27.18 arc90 J23.1
BOOT  (via drill 0.2)
  Top 0.254: U3.46 7.08,11.84 6.79,11.56 v6.79,11.05 5.91,10.16 R5.1
  Route15 0.203: J3.1 1.4,24 1.4,22.1 1.78,21.72 1.78,19.81 2.16,19.43 2.16,17.53 2.54,17.14 2.54,15.24 2.92,14.86 2.92,12.83 3.43,12.32 3.43,11.3 3.68,11.05 v6.79,11.05
CIPO  (via drill 0.2)
  Top 0.254: U3.5 10.55,9.41 v10.54,9.4
  Route15 0.203: v10.54,9.4 10.54,7.75 9.78,6.99 1.91,6.99 1.27,7.62 J10.1
COPI  (via drill 0.2)
  Top 0.254: U3.4 10.05,9.42 v10.03,9.4
  Route15 0.203: v10.03,9.4 10.03,8.13 9.27,7.37 2.79,7.37 J9.1
CS  (via drill 0.2)
  Top 0.254: U3.2 9.05,9.43 v9.02,9.4
  Route15 0.203: v9.02,9.4 9.02,8.89 8.26,8.13 3.05,8.13 1.78,9.4 1.78,11.43 1.4,11.81 1.4,13.84 J7.1
FLASH_PWR  (via drill 0.2)
  Top 0.406: v17.4,5.08 17.53,5.08 17.78,5.33 L1.2
  Route15 0.406: v17.4,5.08 18.03,5.71 18.03,9.78 18.41,10.16 J16.1
FLASH_VCC
  Top 0.203: U7.7 17.14,7.62 16.76,7.24 C50.1
  Top 0.254: U7.3 16.64,10.16 16.76,10.03 17.78,10.03 18.03,9.78 18.03,8.95 17.64,8.55 U7.8 17.64,7.5 17.78,7.37 L1.1
  Top 0.406: C50.1 L1.1
FLSH_CEN  (via drill 0.2)
  Top 0.254: U3.15 15.27,11.84 v15.49,12.06 16.38,12.06 16.51,11.94 17.27,11.94 17.64,11.57 U7.1
  Route15 0.254: v15.49,12.06 15.88,12.45 15.88,19.18 18.03,21.34 18.8,21.34 J21.1
FLSH_SCLK  (via drill 0.2)
  Top 0.254: U7.6 16.64,7.62 16.51,7.49 15.88,7.49 v15.3,8.06 14.05,9.31 U3.12
  Route15 0.254: J18.1 18.41,15.24 17.78,14.61 17.78,13.34 18.54,12.57 18.54,11.56 17.4,10.41 17.4,8.89 16.57,8.06 v15.3,8.06
FLSH_SI  (via drill 0.2)
  Top 0.254: U3.13 15.21,10.84 15.49,10.56 15.49,9.14 15.88,8.76 v16.13,8.76 v16.14,8.75 U7.5
  Route15 0.254: v16.13,8.76 16.64,9.27 16.64,15.11 19.3,17.78 J19.1
FLSH_SO  (via drill 0.2)
  Top 0.254: U3.14 15.78,11.34 v15.88,11.43 16.89,11.43 17.14,11.18 U7.2
  Route15 0.254: v15.88,11.43 16.26,11.81 16.26,17.78 18.8,20.32 J20.1
G8  (via drill 0.2)
  Top 0.305: K1.1 4.08,30.73 v3.24,30.73
  Bottom 0.305: v3.24,30.73 2.98,30.48 J1.1
GND  (via drill 0.2)
  Top 0.254: v12.7,18.16 12.7,18.1 13.05,17.74 U3.27 13.05,16.35 13.4,16 v13.72,16 14.05,16.34 U3.25 14.05,17.48 v14.22,17.65 | U4.2 9.02,24.39 8.64,24 | X1.2 4.73,14.99 v6.35,14.99 6.99,14.99 7.34,15.34 U3.39 8.6,15.34 8.89,15.05 v8.89,14.86 | X1.2 4.54,14.99 v3.94,14.99 3.33,14.99 X1.1 3.21,14.87 | C34.2 C35.2 v17.02,19.57 | C40.2 C41.2 17.02,17.07 17.08,17.14 v17.08,17.16 | C39.2 C38.2 17.14,13.09 v17.14,12.51 | X1.2 4.64,14.04 C5.2 C6.2 4.06,13.02 v3.94,13.14 | v12.13,18.16 11.93,17.97 11.93,17.48 12.05,17.36 U3.29 12.05,16.01 v12.06,16 11.81,16 11.55,16.26 U3.30 11.55,17.78 v11.18,18.16 11.05,18.04 U3.31 11.05,16.26 10.79,16 v10.54,16 10.55,16.01 U3.32 10.55,17.96 10.54,17.97 | R4.2 4.39,11.11 3.94,11.56 v3.94,11.62 | v3.81,23.69 U6.2 | 4.31,16.89 C10.2 | U7.4 16.14,9.98 v16.13,9.97
  Top 0.305: K1.2 3.26,29.89 v3.24,29.91 | C10.2 4.31,16.63 3.94,16.26 v3.94,14.99 | 19.49,26.16 19.56,26.16 J22.1 | 18.61,25.02 18.52,24.93 18.52,24.13 18.52,24
  Top 0.356: v3.87,8.89 4.9,7.87 C49.2
  Top 0.406: v14.22,17.65 14.4,17.83 L11.P$1 L12.P$1 14.4,24.5 v14.41,24.51 v14.41,25.78 14.41,26.42 v14.67,26.67 v14.67,27.94 U5.2 v12.7,27.94 | 10.54,17.97 10.54,20.18 R6.1 10.53,24 10.79,24.26 v10.79,24.89 | 8.64,24 v8.64,18.16 | v3.37,5.14 U2.2 v3.37,6.35 3.37,6.68 C3.2 | v12.7,18.16 v12.7,18.8 v12.7,20.07 v12.7,21.34 v12.7,22.61 v12.7,23.88 v12.7,25.15 v12.7,26.42 v12.7,27.94 | C44.2 12.5,27.74 v12.7,27.94 | C10.2 C9.2 5.4,16.82 | C8.2 C7.2 7.04,18.04 v7.11,17.97 | v11.24,3.75 10.92,3.43 | U1.2 10.92,3.43 | v11.24,3.11 10.92,3.43 | C26.2 7.81,6.99 v8.32,6.48 8.76,6.92 C27.2 | C32.2 10.67,6.92 v11.11,6.48 11.62,6.99 C33.2 | 19.49,26.16 arc-90 18.61,25.02 | C50.2 16.76,5.33 16.57,5.14 v16.32,5.14
  Top 0.61: C19.2 C16.2 C14.2 3.63,27.76 v3.56,27.69 | J22.1 19.79,25.4 | 18.52,24 J25.2 | J24.1 v18.73,30.48 | J12.1 v1.59,2.54 | C1.2 SCREEN.2
  Top 0.813: 19.79,25.4 18.52,24.13
  Top 1.016: J13.1 v18.73,2.54
  Route2 0.61: J22.1 19.05,25.4 v18.16,26.29 | J24.1 v18.73,30.48 | J12.1 v1.59,2.54
  Route2 1.016: J13.1 v18.73,2.54
  Route15 0.61: J22.1 19.05,25.4 v18.16,26.29 | J24.1 v18.73,30.48 | J12.1 v1.59,2.54
  Route15 1.016: J13.1 v18.73,2.54
  Bottom 0.61: J22.1 19.05,25.4 v18.16,26.29 | J24.1 v18.73,30.48 | J12.1 v1.59,2.54
  Bottom 1.016: J13.1 v18.73,2.54
  other vias: 14.41,19.43 14.41,18.16 14.41,21.97 14.41,23.24 13.72,13.59 13.72,14.86 12.06,13.59 10.54,13.59 8.89,13.59 8.89,16 8.89,11.18 10.54,11.18 12.06,11.18 13.72,11.18 13.72,12.32 8.89,12.32 14.41,20.7 10.54,18.1 10.54,19.43 10.54,21.34 10.54,22.61 10.54,23.88 8.64,23.88 8.64,22.61 8.64,21.34 8.64,20.07 8.64,18.8 16.89,28.83 16,25.53 18.16,27.56 18.16,22.23 16.13,22.23 8.76,26.29 9.27,26.8 9.78,26.29 9.27,25.78 9.27,26.29 4.45,21.72 5.91,21.78 5.78,25.72 7.43,24.51 5.33,3.87 11.87,23.56 10.67,30.73 12.57,30.73 13.59,30.73 16.89,30.73 10.67,28.96 10.92,27.81 12.45,28.96 11.68,30.73 15.11,30.73 9.78,30.73 13.27,9.08 2.29,1.71 19.05,29.21 18.16,28.32 18.73,6.79 2.6,31.18 7.75,2.22 10.16,0.95 1.59,6.35 1.46,26.67 1.59,32.07 1.59,29.21 10.16,32.07 18.73,16.51 18.73,13.72 18.73,8.89 18.73,0.92 5.46,23.69 18.73,10.92 13.84,2.35 14.92,9.33
  cutout Route2 (isolate 0.305): 12.95,27.81 14.1,27.81 14.1,17.91 13.84,17.65 13.84,16.51 13.21,16.51 13.21,17.78 12.95,18.03
  pour Top (isolate 0.254, rank 3): 0,33.02 20.32,33.02 20.32,0 0,0
  pour Route2 (isolate 0.203, rank 2): 0,33.02 20.32,33.02 20.32,0 0,0
  pour Route15 (isolate 0.254, rank 2): 0,33.02 20.32,33.02 20.32,0 0,0
  pour Bottom (isolate 0.254, rank 2): 0,33.02 20.32,33.02 20.32,0 0,0
  pour Top (isolate 0.102): 8.38,25.15 10.79,25.15 10.79,16.26 8.38,16.26
  pour Top (isolate 0.102, rank 2): 12.51,27.43 14.61,27.43 14.61,16.26 12.51,16.26
  pour Top (isolate 0.102): 9.02,31.11 14.61,31.11 14.61,25.15 9.02,25.15
  pour Top (isolate 0.102): 14.61,31.11 19.05,31.11 19.05,21.59 14.61,21.59
INT1  (via drill 0.2)
  Top 0.254: U3.47 7.34,11.34 7.24,11.24 v7.24,10.54
  Route15 0.203: J4.1 1.4,21.46 1.4,19.56 1.78,19.18 1.78,17.27 2.16,16.89 2.16,14.99 2.54,14.61 2.54,12.57 3.05,12.06 3.05,10.92 3.43,10.54 v7.24,10.54
INT2  (via drill 0.2)
  Top 0.254: U3.48 7.87,10.81 7.87,10.41 v7.49,10.03
  Route15 0.203: J5.1 1.4,18.92 1.4,17.02 1.78,16.64 1.78,14.73 2.16,14.35 2.16,12.32 2.54,11.94 2.54,10.67 3.17,10.03 v7.49,10.03
N$1
  Top 0.61: Q2.3 15.45,5.42 15.15,5.12 R9.1 14.73,3.94 14.22,3.43 U1.5
N$2
  Top 0.254: R2.1 9.4,4.95 9.65,5.21 12.06,5.21 12.31,4.96 14.1,4.96 14.35,5.21 14.35,7.37 14.16,7.55 Q2.1
N$3  (via drill 0.2)
  Top 0.305: v11.81,2.41 11.88,2.48 U1.4
  Top 0.406: R11.1 v7.11,4.95 R2.2
  Bottom 0.305: v7.11,4.95 7.11,3.81 9.14,1.78 11.18,1.78 v11.81,2.41
N$4
  Top 0.254: U3.24 14.7,17.05 15.5,17.85 C34.1 C35.1 L13.1
N$5
  Top 0.254: L15.1 C41.1 C40.1 16.02,15.38 15.55,15.85 15.18,15.85 15.18,15.84 U3.23
N$6
  Top 0.406: C2.1 6.47,3.94 R11.2
N$7
  Top 0.305: U1.1 10.2,4.32 9.39,4.32 9.01,3.94 C23.1
N$8
  Top 0.254: L9.1 C26.1 C27.1 8.76,8.7 8.95,8.89 10.86,8.89 11.05,9.09 U3.6
N$9  (via drill 0.2)
  Top 0.254: L10.1 C32.1 C33.1 12.38,8.25 v12.42,8.28 12.42,8.92 12.55,9.05 U3.9 | R5.2 R8.1 4.71,8.7 4.9,8.51 6.06,8.51 6.51,8.95 v7.3,8.95
  Bottom 0.254: v12.42,8.28 12,8.7 7.56,8.7 v7.3,8.95
N$10  (via drill 0.2)
  Top 0.254: L4.1 C13.1 C12.1 C11.1 7.04,20.01 8.06,18.99 8.06,17.91 8.32,17.66 v8.76,17.66 9.05,17.36 U3.35 | U3.28 12.55,17.59 v12.43,17.72 | U3.33 10.05,17.6 v10.11,17.66
  Bottom 0.254: v12.43,17.72 12.36,17.66 v10.11,17.66 v8.76,17.66
N$11
  Top 0.254: L3.1 C8.1 C7.1 7.06,19.04 7.68,18.41 7.68,17.27 7.97,16.99 U3.36
N$12
  Top 0.254: U3.41 7.45,14.34 6.41,13.3 6.41,11.37 6.16,11.11 R4.1
N$13
  Top 0.254: L2.1 C6.1 C5.1 6.54,13.97 7.41,14.84 U3.40
N$14
  Top 0.254: U3.37 7.41,16.34 6.99,16.76 C9.1 6.34,17.15 6.1,17.4 3.56,17.4 3.31,17.15 C10.1
  Top 0.305: X1.4 3.24,16.69 C10.1
N$15
  Top 0.254: X1.3 5.5,15.84 C17.1
N$16
  Top 0.254: U3.38 6.69,15.84 C17.2
N$17
  Top 0.254: U3.34 9.55,18.14 C24.1
N$18
  Top 0.254: R6.2 | 9.53,21.21 C25.1
  Top 0.305: C24.2 R6.2 | R6.2 9.53,21.21
N$19
  Top 0.254: L5.P$2 U4.14
N$20
  Top 0.254: R3.1 C15.1 C18.1 5.73,26.73 L5.P$1
N$21
  Top 0.254: C29.P$1 13.54,20.92 13.53,20.91 13.54,20.9 | 13.55,18.78 L11.P$2 arc-45 L11.P$2 | U3.26 13.55,17.96 13.54,17.97
  Top 0.508: 13.54,17.97 L11.P$2 | L11.P$2 13.54,20.9
N$24
  Top 0.305: C25.2 L7.P$1
N$25
  Top 0.254: L7.P$2 U4.3
N$26
  Top 0.254: U4.10 9.78,27.74 U4.9
  Top 0.305: 9.78,27.74 9.78,28.75 L6.P$2 9.77,29.27 9.86,29.36 L8.P$1
N$28
  Top 0.305: C31.1 13.58,28.64 U5.1
N$29
  Top 0.406: U5.3 13.63,27.22 13.53,27.11
  Top 0.508: C30.1 13.53,27.11 13.59,27.18
N$30
  Top 0.305: U5.5 C37.2
N$31
  Top 0.254: U3.20 15.94,14.34 C39.1 C38.1 L14.1
PA_PD  (via drill 0.2)
  Top 0.254: U3.7 11.56,9.59 11.95,9.2 v11.95,9.14 | v11.87,18.67 R17.1
  Route15 0.203: v11.95,9.14 11.75,9.14 11.37,9.53 11.37,17.4 11.62,17.65 11.62,18.41 v11.87,18.67
PD  (via drill 0.2)
  Top 0.254: U4.6 v11.87,26.04 | C44.1 v11.87,26.04 | v11.87,26.04 C43.2 11.82,25.28 | R17.2 v11.87,21.14 R14.2
  Route15 0.254: v11.87,21.14 11.37,21.65 11.37,25.53 v11.87,26.04
PWR_EN  (via drill 0.2)
  Top 0.305: R12.1 9.2,2.48 v9.4,2.48 U1.3
  Bottom 0.305: J15.1 16.38,7.62 14.48,5.71 10.16,5.71 9.4,4.95 v9.4,2.48
RESETB  (via drill 0.2)
  Top 0.254: U3.1 8.55,9.89 8.19,9.53 v7.49,9.53 6.02,9.53 R8.2
  Route15 0.203: J6.1 1.4,16.38 1.4,14.48 1.78,14.1 1.78,12.06 2.16,11.68 2.16,10.41 3.05,9.53 v7.49,9.53
RF_RX
  Top 0.508: C29.P$2 L12.P$2 13.54,25.01 C30.2
RF_TX
  Top 0.305: L8.P$2 10.77,29.9 C28.2 C31.2
RFG8  (via drill 0.2)
  Top 0.254: U4.12 8.2,27.74 v8,27.94
  Top 0.305: K1.4 6.14,30.8 v6.92,30.8 7.63,30.8 R7.1 C22.2
  Bottom 0.254: v8,27.94 7.49,28.45 7.49,30.23 v6.92,30.8
RXSW  (via drill 0.2)
  Top 0.254: v15.88,29.15 15.88,28.63 U5.6 | U3.22 15.3,15.34 v15.37,15.4
  Top 0.305: C36.1 v15.88,29.15
  Bottom 0.203: v15.37,15.4 16.26,16.29 16.26,17.92 17.5,19.16 17.5,19.75 14.99,22.27 14.99,26.04 15.24,26.29 15.24,27.56 15.88,28.19 v15.88,29.15
SCLK  (via drill 0.2)
  Top 0.254: U3.3 9.55,9.43 v9.53,9.4
  Route15 0.203: v9.53,9.4 9.53,8.76 8.51,7.75 2.92,7.75 1.4,9.27 1.4,11.3 J8.1
TXSW  (via drill 0.2)
  Top 0.203: C42.1 16.67,20.92 17.82,20.92 v18.16,20.57
  Top 0.254: v15.83,26.73 U5.4 | U3.21 14.72,14.86 v15.37,14.86
  Bottom 0.203: v15.37,14.86 v15.38,14.87 15.54,14.87 16.64,15.97 16.64,17.77 17.83,18.96 17.83,19.89 17.66,20.07 | v15.83,26.73 15.62,26.52 15.62,26.08 15.37,25.82 15.37,22.36 17.66,20.07 | v18.16,20.57 17.66,20.07
VDD  (via drill 0.2)
  Top 0.203: U2.1 4.02,4.9 3.81,4.7 2.92,4.7 2.72,4.9 U2.3
  Top 0.305: L15.2 17.97,17.08 v17.91,17.14 | C19.1 6.42,28.77 | 8.71,28.77 L6.P$1
  Top 0.406: U6.1 3.94,24.64 4.45,24.13 4.45,23.24 3.94,22.73 U6.3 | U2.1 4.02,6.94 C3.1
  Top 0.508: U6.1 2.67,24.64 2.29,25.02 | R3.2 2.36,25.73 2.29,25.65 | U6.3 2.57,22.48 | 2.57,22.48 2.44,22.35 | 2.57,22.48 2.48,22.48
  Top 0.61: 2.29,25.02 2.29,25.65 2.29,27.69 2.92,28.32 | 2.92,28.32 3.36,28.76 C14.1 C16.1 6.42,28.77 8.71,28.77 | C46.1 2.54,28.7 2.92,28.32 | 9.78,5.84 12.4,5.84 12.65,5.59 13.29,5.59 Q2.2 | 2.44,22.35 2.44,18.03 | 2.44,18.03 2.44,13.97 | 2.44,13.97 2.44,13.05 3.17,12.32 3.17,8.57 4.06,7.69 C3.1 4.56,6.99 4.69,6.86 5.09,6.86 5.1,6.87 C49.1 C45.1 5.34,5.84 9.78,5.84 | v3.94,13.97 2.44,13.97 | L3.2 2.45,18.04 2.44,18.03 | L10.2 9.72,5.91 9.78,5.84
  Bottom 0.508: v17.91,17.14 17.91,16.32 16.41,14.83 | v3.94,13.97 6.43,13.97 6.62,14.16 15.75,14.16 16.41,14.83 | 16.41,14.83 18.54,12.7 J17.1
VIN  (via drill 0.2)
  Top 0.305: U1.6 13.9,4.38 v13.97,4.45
  Top 0.406: U1.6 12,4.38 v11.68,4.7
  Top 0.61: C1.1 C48.1 16.64,3.73 R9.2
  Top 1.016: J14.1 19.01,5.08 17.87,3.94 R9.2
  Bottom 0.61: J14.1 18.92,5.08 17.78,3.94 14.48,3.94 v13.97,4.45 13.72,4.7 v11.68,4.7
VREF1  (via drill 0.2)
  Top 0.254: v7.56,27.62 7.82,27.36 U4.13 | U4.16 6.62,25.54 v6.6,25.53
  Top 0.305: K1.3 6.94,29.89 v6.99,29.84
  Top 0.406: U6.5 v6.6,24.64 | v6.6,24.64 6.6,23.69 | 6.6,23.69 6.6,21.99 6.88,21.71 C20.2 | v6.6,24.64 v6.6,25.53 | C21.2 6.61,23.68 6.6,23.69
  Bottom 0.406: v6.99,29.84 6.99,28.32 | 6.99,28.32 6.99,28.19 v7.56,27.62 6.6,26.67 v6.6,25.53 v6.6,24.64 | J2.1 1.4,27.94 1.78,28.32 6.99,28.32

### Text on the board
Bottom: X01
Measures: Dimensions in Inches
tDocu: JLCPCB JLC7628 4-Layer 0.8mm Impedance Control / 4-Layer Board / 0.8mm Thickness / 1oz Copper (Outer layers) / ENIG Finish / Castellated Holes / / When running the panelizer, add a vertical gap of 0.2" / to allow the castellated holes to be routed out | Paul Clark